# Altium project New_Member_Project.PrjPcb
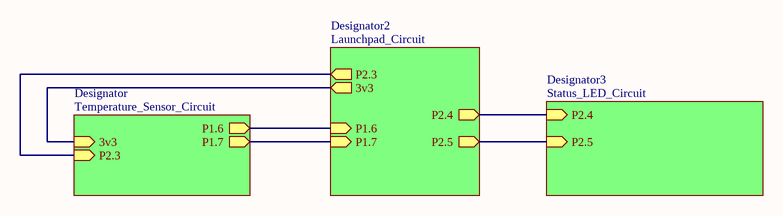
[diagram p0: Master_Sheet.SchDoc]
4 sheets, 9 parts. Net scope: hierarchical (ports join the sheet entries above them; power ports are global).
Board file: Final_PCB.PcbDoc
Sheets:
  Master_Sheet.SchDoc
    Designator = Temperature_Sensor_Circuit.SchDoc
    Designator2 = Launchpad_Circuit.SchDoc
    Designator3 = Status_LED_Circuit.SchDoc

## Sheet Master_Sheet.SchDoc
size A; SheetNumber: 1; SheetTotal: 4

### Sub-sheets
Designator = Temperature_Sensor_Circuit: P1.6 (out), P1.7 (out), 3v3 (in), P2.3 (in)
Designator2 = Launchpad_Circuit: P2.3 (out), 3v3 (out), P1.6 (in), P1.7 (in), P2.4 (out), P2.5 (out)
Designator3 = Status_LED_Circuit: P2.5 (in), P2.4 (in)

### Nets
LED_SENSE1: sheet Designator2/P2.5, sheet Designator3/P2.5
LED_VCC1: sheet Designator2/P2.4, sheet Designator3/P2.4
NFET_GATE1: sheet Designator/P2.3, sheet Designator2/P2.3
SCL: sheet Designator/P1.6, sheet Designator2/P1.6
SDA: sheet Designator/P1.7, sheet Designator2/P1.7
VCC: sheet Designator/3v3, sheet Designator2/3v3

## Sheet Temperature_Sensor_Circuit.SchDoc
size A; SheetNumber: 2; SheetTotal: 4
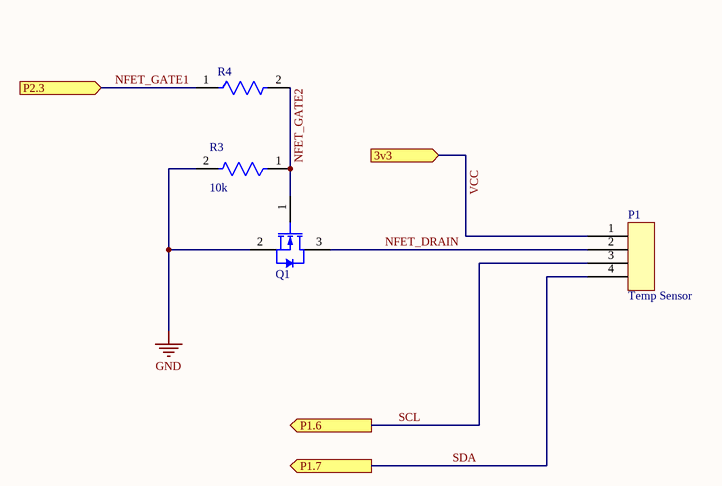
[diagram p1: Temperature_Sensor_Circuit.SchDoc]

### Parts
P1  Temp Sensor  [1X4 HEADER]
Q1  BSS123  [FAIR-SOT23-3_V]  (value not drawn)
R3  10k  [FP-RC3216-IPC_C]
R4  (no value)  [FP-CR1206-IPC_A]

### Ports
3v3 (in), P1.6 (out), P1.7 (out), P2.3 (in)

### Nets
GND: Q1.2(S) R3.2
NFET_DRAIN: P1.2 Q1.3(D)
NFET_GATE1: R4.1 ; port P2.3
NFET_GATE2: Q1.1(G) R3.1 R4.2
SCL: P1.3 ; port P1.6
SDA: P1.4 ; port P1.7
VCC: P1.1 ; port 3v3

### Library data of the parts
P1 = 1X4 HEADER
Q1 = CMP-2000-04934-1: N-Channel Logic Level Enhancement Mode Field Effect Transistor, 1.7 V, -55 to 150 degC, 3-Pin SOT-23, RoHS, Tape and Reel; Manufacturer: Fairchild; Channel Type: N; Typical Turn-Off Delay Time: 17ns; Maximum Continuous Drain Current: 0.17A; Rad Hard: No; Typical Rise Time: 9ns; Typical Fall Time: 2.4ns; Maximum Gate Source Voltage: ±20V; Maximum Drain Source Voltage: 100V; Typical Turn-On Delay Time: 1.7ns; RDS-on: 6000@10VmOhm; Package Version: Rev. 12, 03/2016; Packaging: Tape&Reel; Package Reference: SOT23-3; Channel Mode: Enhancement; Operating Temperature: -55to150degC; Package Description: 3-Pin Small Outline Transistor, Body 2.92 x 1.325 mm, Pitch 0.95 mm; Category: MOSFET; Datasheet Version: Jun-03; Datasheet URL: https://www.fairchildsemi.com/datasheets/BS/BSS123.pdf; Manufacturer URL: https://www.fairchildsemi.com/; Mounting: SurfaceMount; Package: 3SOT-23; Package URL: http://www.fairchildsemi.com/dwg/MA/MA03D.pdf
R3 = CMP-13261-005388-1: Res Thick Film 1206 10kΩ 5% 0.25W ±100ppm/°C Molded SMD T/R; Resistance: 10kR; Voltage Rating (DC): 200V; Max Power Dissipation: 250mW; Case Code (Metric): 3216; Radiation Hardening: No; Contact Plating: Tin; Packaging: Tape and Reel; Case Code (Imperial): 1206; Composition: Thick Film; Height: 0.026inch; Features: Moisture Resistant; Temperature Coefficient: 100ppm/°C; Tolerance: 5%; Length: 0.126inch; Min Operating Temperature: -55°C; Depth: 1.6mm; Case/Package: 1206; Number of Terminations: 2; Width: 0.063inch; Lead Free: Lead Free; Military Standard: Not; Max Operating Temperature: 155°C
R4 = CMP-07231-000980-1: Thick Film Chip Resistors 1206 100Ω 0.25W 1% 100ppm/°C; Max Power Dissipation: 250mW; Voltage Rating: 200V; Resistance: 100R; Features: Moisture Resistant; Mount: Surface Mount; Composition: Thick Film; Contact Plating: Tin; Depth: 1.6mm; Number of Terminations: 2; Length: 0.126inch; Power Rating: 250mW; Temperature Coefficient: 100ppm/°C; Case Code (Metric): 3216; Radiation Hardening: No; Height: 0.03inch; Packaging: Tape and Reel; Height - Seated (Max): 0.03inch; Thickness: 610um; Case Code (Imperial): 1206; Package Quantity: 1; Tolerance: 1%; Max Operating Temperature: 155°C; Termination: SMD/SMT; Width: 0.063inch; Military Standard: Not; Case/Package: 1206; Min Operating Temperature: -55°C

## Sheet Launchpad_Circuit.SchDoc
size A; SheetNumber: 3; SheetTotal: 4
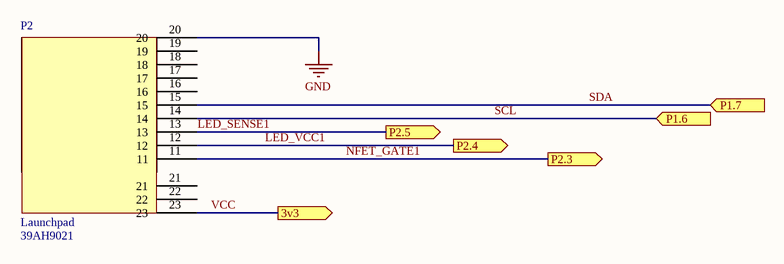
[diagram p2: Launchpad_Circuit.SchDoc]

### Parts
P2  Launchpad  Supplier Part Number 1: 39AH9021  [MSP430MG2553 Single Row (13 Pin)]

### Ports
3v3 (out), P1.6 (in), P1.7 (in), P2.3 (out), P2.4 (out), P2.5 (out)

### Nets
GND: P2.20
LED_SENSE1: P2.13 ; port P2.5
LED_VCC1: P2.12 ; port P2.4
NFET_GATE1: P2.11 ; port P2.3
SCL: P2.14 ; port P1.6
SDA: P2.15 ; port P1.7
VCC: P2.23 ; port 3v3

Not connected (* = marked no-connect by the designer): P2 16 17 18 19 21 22

### Library data of the parts
P2 = MSP430MG2553 Single Row (13 Pin): 13 pin header for one side of MSP430MG2553; Manufacturer: Texas Instruments; Manufacturer Part Number: MSP-EXP430G2; Core Architecture: MSP430; Evaluation Kit: Yes; Interface: USB; Data Bus Width: 16b; Number of Bits: 16; Supplier 1: Newark; RoHS: Yes; Category: Embedded Processors and Controllers; Mount: Socket; Number of Pins: 0.7; Weight: 0.22lb; Packaging: Bulk; Package Quantity: 1; Length: 3.94inch; Height: 1.97inch; Width: 3.94inch; Radiation Hardening: No; REACH SVHC: No SVHC; ComponentLink1URL: https://datasheet.ciiva.com/2398/slay017-2398228.pdf?src-supplier=Digi-Key; ComponentLink1Description: https://datasheet.ciiva.com/2398/slay017-2398228.pdf?src-supplier=Digi-Key; ComponentLink2URL: https://datasheet.ciiva.com/27059/2207275-27059764.pdf?src-supplier=Jameco; ComponentLink2Description: https://datasheet.ciiva.com/27059/2207275-27059764.pdf?src-supplier=Jameco; ComponentLink3URL: https://datasheet.ciiva.com/20167/73-4724-20167738.pdf?src-supplier=Rapid+Electronics; ComponentLink3Description: https://datasheet.ciiva.com/20167/73-4724-20167738.pdf?src-supplier=Rapid+Electronics; ComponentLink4URL: https://datasheet.ciiva.com/26344/414784-da-01-en-launchpad-devel-tool-msp-exp430g2-tid-26344585.pdf?src-supplier=Conrad; ComponentLink4Description: https://datasheet.ciiva.com/26344/414784-da-01-en-launchpad-devel-tool-msp-exp430g2-tid-26344585.pdf?src-supplier=Conrad

## Sheet Status_LED_Circuit.SchDoc
size A; SheetNumber: 4; SheetTotal: 4
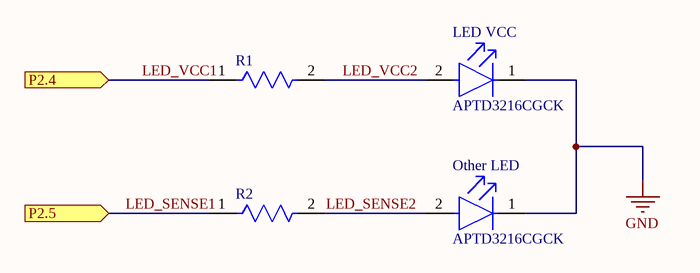
[diagram p3: Status_LED_Circuit.SchDoc]

### Parts
LED_VCC  APTD3216CGCK  [FP-APTD3216CGCK-MFG]
Other_LED  APTD3216CGCK  [FP-APTD3216CGCK-MFG]
R1  RC3216J103CS  [FP-RC3216-IPC_C]  (value not drawn)
R2  RC3216J103CS  [FP-RC3216-IPC_C]  (value not drawn)

### Ports
P2.4 (in), P2.5 (in)

### Nets
GND: LED_VCC.1(C) Other_LED.1(C)
LED_SENSE1: R2.1 ; port P2.5
LED_SENSE2: Other_LED.2(A) R2.2
LED_VCC1: R1.1 ; port P2.4
LED_VCC2: LED_VCC.2(A) R1.2

### Library data of the parts
LED_VCC Other_LED = CMP-2000-05792-2: LED GREEN CLEAR 2SMD; Forward Voltage: 2.1V; Forward Current: 20mA; Luminous Intensity: 300mcd; Number of LEDs: 1; Dominant Wavelength: 570nm; Viewing Angle: 50°; Lead Free: Lead Free; Lens Color: Clear; Mount: Surface Mount; Package Quantity: 2000; Height: 1.8mm; Number of Pins: 2; Test Current: 20mA; Case Code (Metric): 3216; Case/Package: 1206; Case Code (Imperial): 1206; Illumination Color: Green; Color: Green; Width: 1.6mm; Packaging: Tape and Reel; Min Operating Temperature: -40°C; Lens Style: Clear; Max Operating Temperature: 85°C; Length: 3.2mm
R1 R2 = CMP-13261-005388-1: as R3 on sheet Temperature_Sensor_Circuit; Case Code (Metric): 3216; Radiation Hardening: No; Contact Plating: Tin; Packaging: Tape and Reel; Case Code (Imperial): 1206; Composition: Thick Film; Height: 0.026inch; Features: Moisture Resistant; Temperature Coefficient: 100ppm/°C; Tolerance: 5%; Length: 0.126inch; Min Operating Temperature: -55°C; Depth: 1.6mm; Case/Package: 1206; Number of Terminations: 2; Width: 0.063inch; Lead Free: Lead Free; Military Standard: Not; Max Operating Temperature: 155°C

## Nets that join several sheets
GND: Temperature_Sensor_Circuit (Q1.2 R3.2), Launchpad_Circuit (P2.20), Status_LED_Circuit (LED_VCC.1 Other_LED.1)
LED_SENSE1: Launchpad_Circuit (P2.13), Status_LED_Circuit (R2.1)
LED_VCC1: Launchpad_Circuit (P2.12), Status_LED_Circuit (R1.1)
NFET_GATE1: Temperature_Sensor_Circuit (R4.1), Launchpad_Circuit (P2.11)
SCL: Temperature_Sensor_Circuit (P1.3), Launchpad_Circuit (P2.14)
SDA: Temperature_Sensor_Circuit (P1.4), Launchpad_Circuit (P2.15)
VCC: Temperature_Sensor_Circuit (P1.1), Launchpad_Circuit (P2.23)